# Altium schematic sheet mosfetsema.SchDoc
size A; SPICEModelCacheHYUHBJXB: <root> / <DocumentId>HYUHBJXB</DocumentId> / <CacheFrame Number="0"> / <Model Name="865080343009_100uf" Kind="CKT"> / <Text>******* / .subckt 865080343009_100uF 1 2 / Rser 1 3 0.9 / Lser 2 4 2.918567665E-09 / C1 3 4 0.0001 / Rpar 3 4 1000000 / .ends 865080343009_100uF</Text> / </Model> / </CacheFrame> / </root>
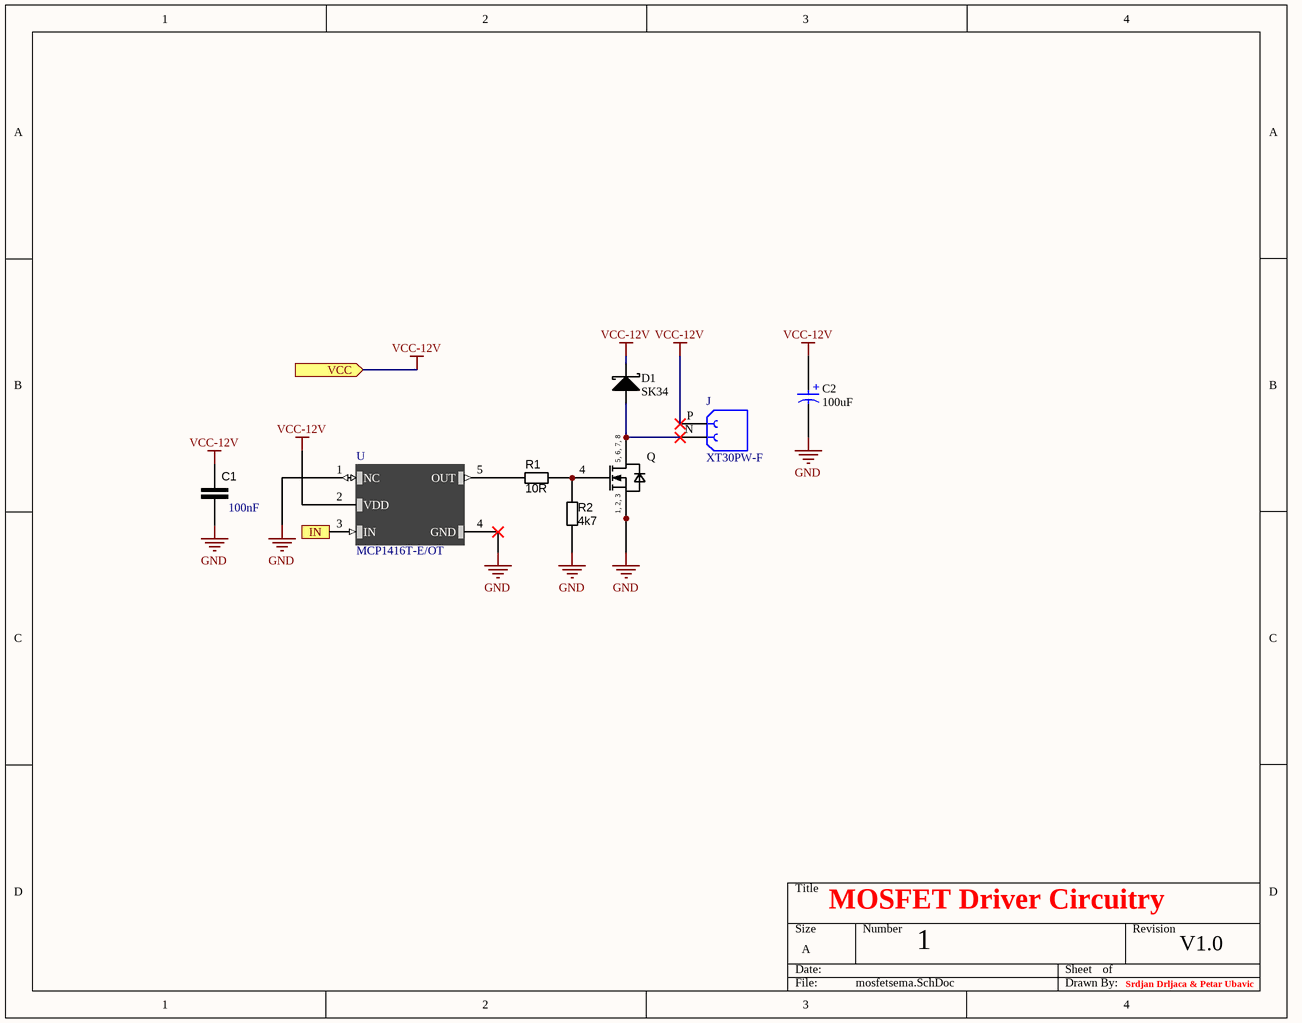
[diagram p0: mosfetsema.SchDoc]

## Parts
C1  100nF  [CAP_1206]
C2  100uF  [WCAP-ASLI_D6.3H5.5]
D1  SK34  [DO214AC]
J  XT30PW-F  [AMASS_XT30PW-F]
Q  IPZ40N04S5L-7R4  [INF-PG-TSDSON-8-32-1-V]  (value not drawn)
R1  10R  [RES_0603]
R2  4k7  [RES_0603]
U  MCP1416T-E/OT  [SOT95P270X145-5N]

## Ports
IN (in), VCC (in)

## Nets
GND: C1.1 C2.2(N) Q.1(SOURCE) Q.2(SOURCE) Q.3(SOURCE) R2.1 U.1(NC) U.4(GND)
VCC-12V: C1.2 C2.1(P) D1.1(Cathode) J.P U.2(VDD) ; port VCC
IN: U.3(IN) ; port IN
NetD1_2: D1.2(Anode) J.N Q.5(DRAIN) Q.6(DRAIN) Q.7(DRAIN) Q.8(DRAIN)
NetQ_4: Q.4(GATE) R1.2 R2.2
NetR1_1: R1.1 U.5(OUT)

## Notes on the sheet
- MOSFET Driver Circuitry
- 1
- V1.0
- Srdjan Drljaca & Petar Ubavic
- (in symbol 865080343009) +
- (in symbol IPZ40N04S5L-7R4) 5, 6, 7, 8; 1, 2, 3

## Library data of the parts
C1 = C000017: CAP CER 100nF 50V X7R 1206; capacitance: 100nF; ComponentLink1Description: DigiKey
C2 = 865080343009: WCAP-ASLI Aluminum Electrolytic Capacitor, V-Chip, D6.3 x H5.5mm, 100uF, 16V; Manufacturer: Wurth Elektronik; Capacitance Tolerance: +/-20%; Dissipation Factor: 16%; Endurance: 2000h; Leakage Current: 16uA; Ripple Current: 255mA; Technical Reference: ASED055101M016DVCTBB000; Manufacturer Part Number: 865080343009; Category: Aluminum Electrolytic Capacitors; Match Code: WCAP-ASLI; ComponentLink1Description: Website Link; ComponentLink1URL: https://www.we-online.com/redexpert/article/865080343009?ad; ComponentLink2Description: Datasheet Link; ComponentLink2URL: https://www.we-online.com/redexpert/spec/865080343009?ad; Mount: Surface Mount; Operating Temperature Max: 105°C; Operating Temperature Min: -55°C; Packaging: Tape and Reel; Height: 5.5mm; Diameter: 6.3mm; Capacitance: 100uF; Rated Voltage (DC): 16V
D1 = SK34: DIODE SCHOTTKY 40V 3A DO214AC; Manufacturer: Vishay Semiconductor Diodes Division; Barcode: 0100000007488; id: 62; Assembly: SMD; Speed: Fast Recovery =< 500ns, > 200mA (Io); Voltage  Forward: 550mV @ 3A; item_id: 1025; Recommended Rating: Silver; Manufacturer Part Number: SK34; Category: Discrete Semiconductor Products; Datasheet URL: http://www.vishay.com/docs/88896/b330la.pdf; Package Case: DO-214AC, SMA; Family: DIODE; Voltage  DC Reverse: 40V; Current  Average Rectified: 3A; Diode Type: Schottky; Part Type: Discrete Semiconductors
J = XT30PW-F: MF: {'manufacturer': u'amass'}; Package: None; Price: None; Value: *; MP: XT30PW-F; Availability: Unavailable
Q = IPZ40N04S5L-7R4: Insulated-Gate Field-Effect Transistor (IGFET), N-Channel, Enhancement, Body Diode, Pin 1 Source, 2 Source, 3 Source, 4 Gate, 5 Drain, 6 Drain, 7 Drain, 8 Drain, 8 Pins; Manufacturer: Infineon Technologies; PackageReference: PG-TSDSON-8-32; ManufacturerPartNumber: IPZ40N04S5L-7R4
R1 = R000004: RES 10 OHM 1% 1/10W 0603; resistance: 1Kohm; ComponentLink1Description: digikey; ComponentLink1URL: https://www.digikey.com/en/products/detail/vishay-beyschlag-draloric-bc-components/MCT06030C1001FP500/2607821
R2 = R000004: RES 4k7 OHM 1% 1/10W 0603; resistance: 1Kohm; ComponentLink1Description: digikey; ComponentLink1URL: https://www.digikey.com/en/products/detail/vishay-beyschlag-draloric-bc-components/MCT06030C1001FP500/2607821
U = MCP1416T-E/OT: Low-Side Gate Driver IC Non-Inverting SOT-23-5; MF: Microchip; Price: None; Availability: Good; SnapEDA_Link: https://www.snapeda.com/parts/MCP1416T-E/OT/Microchip/view-part/287469/?ref=snap; Package: SOT-23-5 Microchip; MP: MCP1416T-E/OT; Value: *; Purchase-URL: https://pricing.snapeda.com/search/part/MCP1416T-E/OT/?ref=eda; Check_prices: https://www.snapeda.com/parts/MCP1416T-E/OT/Microchip/view-part/287469/?ref=eda